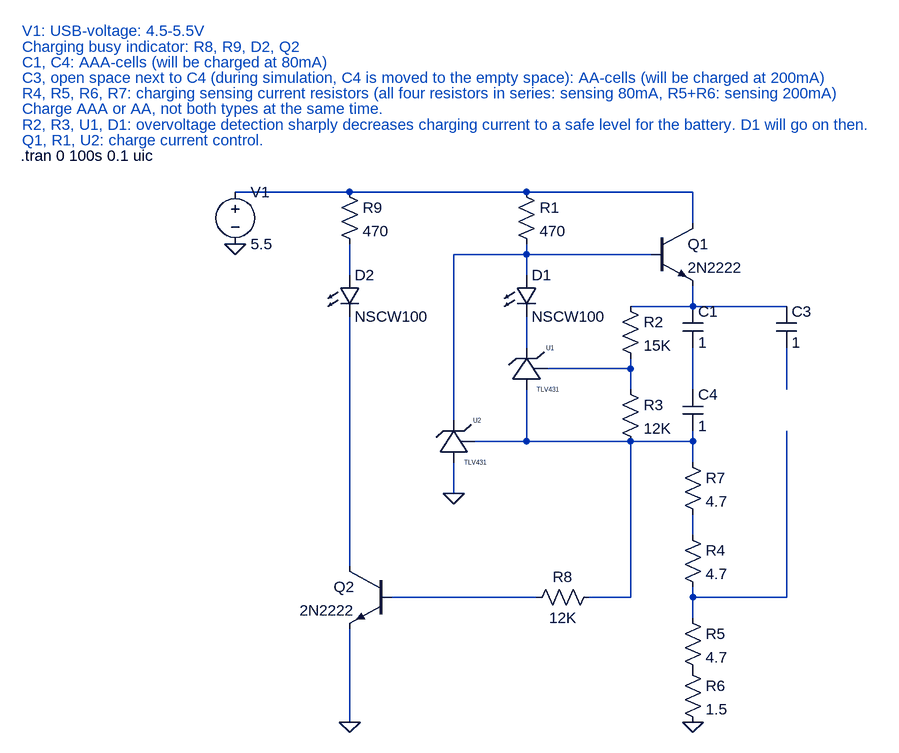
[diagram p0: schematic nuc.asc]
nuc.asc, the LTspice schematic file:
Version 4
SHEET 1 1924 884
WIRE -496 -176 -672 -176
WIRE -224 -176 -496 -176
WIRE 32 -176 -224 -176
WIRE 32 -128 32 -176
WIRE -224 -80 -224 -96
WIRE -224 -80 -336 -80
WIRE -32 -80 -224 -80
WIRE -496 -48 -496 -96
WIRE -224 -48 -224 -80
WIRE 32 0 32 -32
WIRE 32 0 -64 0
WIRE 176 0 32 0
WIRE -224 64 -224 16
WIRE -64 96 -64 80
WIRE -64 96 -192 96
WIRE -64 128 -64 96
WIRE 32 128 32 64
WIRE 176 128 176 64
WIRE -336 176 -336 -80
WIRE -224 208 -224 128
WIRE -224 208 -304 208
WIRE -64 208 -224 208
WIRE 32 208 32 192
WIRE 32 208 -64 208
WIRE 32 240 32 208
WIRE -336 288 -336 240
WIRE 32 352 32 320
WIRE -496 400 -496 16
WIRE -208 448 -432 448
WIRE -64 448 -64 208
WIRE -64 448 -128 448
WIRE 32 448 32 432
WIRE 176 448 176 192
WIRE 176 448 32 448
WIRE 32 480 32 448
WIRE -496 640 -496 496
FLAG -672 -96 0
FLAG 32 640 0
FLAG -336 288 0
FLAG -496 640 0
SYMBOL npn -32 -128 R0
SYMATTR InstName Q1
SYMATTR Value 2N2222
SYMBOL res -240 -192 R0
SYMATTR InstName R1
SYMATTR Value 470
SYMBOL res -80 -16 R0
SYMATTR InstName R2
SYMATTR Value 15K
SYMBOL res -80 112 R0
SYMATTR InstName R3
SYMATTR Value 12K
SYMBOL res 16 336 R0
SYMATTR InstName R4
SYMATTR Value 4.7
SYMBOL res 16 464 R0
SYMATTR InstName R5
SYMATTR Value 4.7
SYMBOL TLV431 -224 96 R0
SYMATTR InstName U1
SYMBOL TLV431 -336 208 R0
SYMATTR InstName U2
SYMBOL cap 16 0 R0
SYMATTR InstName C1
SYMATTR Value 1
SYMBOL cap 160 0 R0
SYMATTR InstName C3
SYMATTR Value 1
SYMBOL cap 16 128 R0
SYMATTR InstName C4
SYMATTR Value 1
SYMBOL voltage -672 -192 R0
SYMATTR InstName V1
SYMATTR Value 5.5
SYMBOL res 16 544 R0
SYMATTR InstName R6
SYMATTR Value 1.5
SYMBOL LED -240 -48 R0
SYMATTR InstName D1
SYMATTR Value NSCW100
SYMATTR Description Diode
SYMATTR Type diode
SYMBOL res 16 224 R0
SYMATTR InstName R7
SYMATTR Value 4.7
SYMBOL npn -432 400 M0
SYMATTR InstName Q2
SYMATTR Value 2N2222
SYMBOL res -112 432 R90
WINDOW 0 0 56 VBottom 2
WINDOW 3 32 56 VTop 2
SYMATTR InstName R8
SYMATTR Value 12K
SYMBOL LED -512 -48 R0
SYMATTR InstName D2
SYMATTR Value NSCW100
SYMATTR Description Diode
SYMATTR Type diode
SYMBOL res -512 -192 R0
SYMATTR InstName R9
SYMATTR Value 470
TEXT -1002 -232 Left 2 !.tran 0 100s 0.1 uic
TEXT -1000 -424 Left 2 ;V1: USB-voltage: 4.5-5.5V
TEXT -1000 -400 Left 2 ;Charging busy indicator: R8, R9, D2, Q2
TEXT -1000 -376 Left 2 ;C1, C4: AAA-cells (will be charged at 80mA)
TEXT -1000 -352 Left 2 ;C3, open space next to C4 (during simulation, C4 is moved to the empty space): AA-cells (will be charged at 200mA)
TEXT -1000 -328 Left 2 ;R4, R5, R6, R7: charging sensing current resistors (all four resistors in series: sensing 80mA, R5+R6: sensing 200mA)
TEXT -1000 -304 Left 2 ;Charge AAA or AA, not both types at the same time.
TEXT -1000 -280 Left 2 ;R2, R3, U1, D1: overvoltage detection sharply decreases charging current to a safe level for the battery. D1 will go on then.
TEXT -1000 -256 Left 2 ;Q1, R1, U2: charge current control.

The netlist it stands for:
* nuc.asc
Q1 N001 N002 N004 0 2N2222
R1 N001 N002 470
R2 N004 N006 15K
R3 N006 N009 12K
R4 N010 N013 4.7
R5 N013 P001 4.7
XU1 N005 N006 N009 TLV431  ; pins C ref A
XU2 N002 N009 0 TLV431  ; pins C ref A
C1 N004 N007 1
C3 N004 N008 1
C4 N007 N009 1
V1 N001 0 5.5
R6 P001 0 1.5
D1 N002 N005 NSCW100
R7 N009 N010 4.7
Q2 N011 N012 0 0 2N2222
R8 N009 N012 12K
D2 N003 N011 NSCW100
R9 N001 N003 470
.model D D
.lib standard.dio
.model NPN NPN
.model PNP PNP
.lib standard.bjt
.tran 0 100s 0.1 uic
* V1: USB-voltage: 4.5-5.5V
* Charging busy indicator: R8, R9, D2, Q2
* C1, C4: AAA-cells (will be charged at 80mA)
* C3, open space next to C4 (during simulation, C4 is moved to the empty space): AA-cells (will be charged at 200mA)
* R4, R5, R6, R7: charging sensing current resistors (all four resistors in series: sensing 80mA, R5+R6: sensing 200mA)
* Charge AAA or AA, not both types at the same time.
* R2, R3, U1, D1: overvoltage detection sharply decreases charging current to a safe level for the battery. D1 will go on then.
* Q1, R1, U2: charge current control.
.lib TLV431.mod
.backanno
.end